# EAGLE design CPUBoard (EAGLE 6.1)
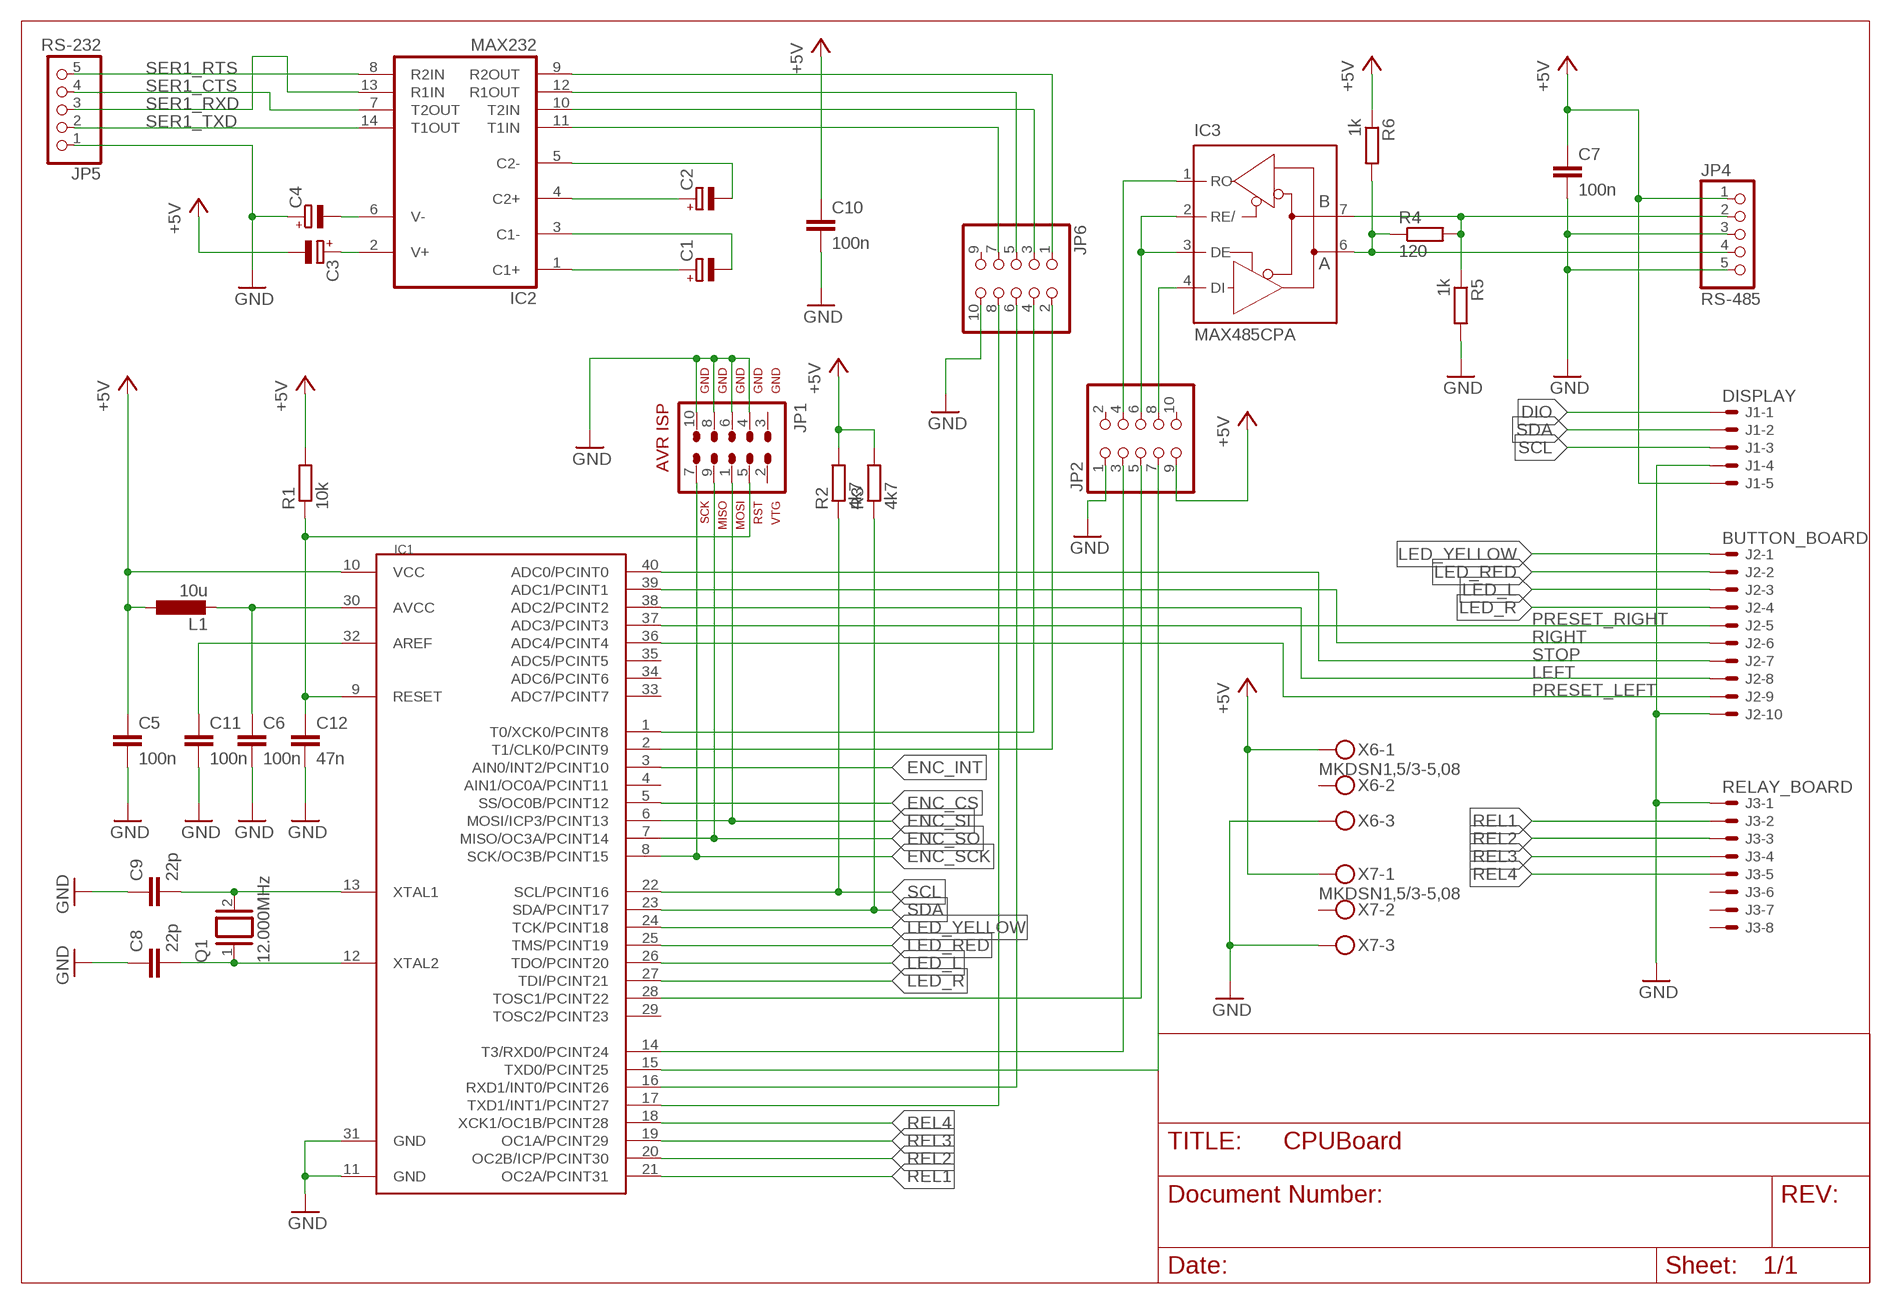
[diagram p0: schematic, sheet 1]

## Parts
C1  CPOL-EUE2,5-6E  [E2,5-6E]
C2  CPOL-EUE2,5-6E  [E2,5-6E]
C3  CPOL-EUE2,5-6E  [E2,5-6E]
C4  CPOL-EUE2,5-6E  [E2,5-6E]
C5  100n  C-EU025-025X050  [C025-025X050]
C6  100n  C-EU025-025X050  [C025-025X050]
C7  100n  C-EU025-025X050  [C025-025X050]
C8  22p  C-EU025-024X044  [C025-024X044]
C9  22p  C-EU025-024X044  [C025-024X044]
C10  100n  C-EU025-025X050  [C025-025X050]
C11  100n  C-EU025-025X050  [C025-025X050]
C12  47n  C-EU025-025X050  [C025-025X050]
IC1  MEGA1284P  [DIL40]
IC2  MAX232  [DIL16]
IC3  MAX485CPA  MAX481CPA  [DIL08]
J1  DISPLAY  22-27-2051-05  [6410-05]
J2  BUTTON_BOARD  22-27-2101-10  [6410-10]
J3  RELAY_BOARD  22-27-2081-08  [6410-08]
JP1  AVR-ISP-10  [AVR-ISP-10]
JP2  PINHD-2X5  [2X05]
JP4  RS-485  PINHD-1X5  [1X05]
JP5  RS-232  PINHD-1X5  [1X05]
JP6  PINHD-2X5  [2X05]
L1  10u  L-EU0207/10  [0207/10]
Q1  12.000MHz  XTAL/S  [QS]
R1  10k  R-EU_0207/10  [0207/10]
R2  4k7  R-EU_0207/10  [0207/10]
R3  4k7  R-EU_0207/10  [0207/10]
R4  120  R-EU_0207/10  [0207/10]
R5  1k  R-EU_0207/10  [0207/10]
R6  1k  R-EU_0207/10  [0207/10]
X6  MKDSN1,5/3-5,08  [MKDSN1,5/3-5,08]
X7  MKDSN1,5/3-5,08  [MKDSN1,5/3-5,08]

## Nets
+5V: C3.- C5.1 C7.1 C10.1 IC1.10(VCC) J1.5 JP2.9 JP4.1 L1.1 R1.2 R2.2 R3.2 R6.1 X6.1 X7.1
DIO: J1.1
ENC_CS: IC1.5(SS/OC0B/PCINT12)
ENC_INT: IC1.3(AIN0/INT2/PCINT10)
ENC_SCK: IC1.8(SCK/OC3B/PCINT15) JP1.7
ENC_SI: IC1.6(MOSI/ICP3/PCINT13) JP1.1
ENC_SO: IC1.7(MISO/OC3A/PCINT14) JP1.9
GND: C4.+ C5.2 C6.2 C7.2 C8.1 C9.1 C10.2 C11.2 C12.2 IC1.11(GND) IC1.31(GND) J1.4 J2.10 J3.1 JP1.4 JP1.6 JP1.8 JP1.10 JP2.1 JP4.3 JP4.5 JP5.1 JP6.10 R5.2 X6.3 X7.3
LED_L: IC1.26(TDO/PCINT20) J2.3
LED_R: IC1.27(TDI/PCINT21) J2.4
LED_RED: IC1.25(TMS/PCINT19) J2.2
LED_YELLOW: IC1.24(TCK/PCINT18) J2.1
LEFT: IC1.38(ADC2/PCINT2) J2.8
N$1: C9.2 IC1.13(XTAL1) Q1.2
N$2: C8.2 IC1.12(XTAL2) Q1.1
N$3: C12.1 IC1.9(RESET) JP1.5 R1.1
N$4: IC2.11(T1IN) JP6.7
N$5: C1.+ IC2.1(C1+)
N$6: C1.- IC2.3(C1-)
N$7: C2.+ IC2.4(C2+)
N$8: C2.- IC2.5(C2-)
N$9: C3.+ IC2.2(V+)
N$10: C4.- IC2.6(V-)
N$11: IC2.12(R1OUT) JP6.5
N$12: C6.1 IC1.30(AVCC) L1.2
N$13: IC1.14(T3/RXD0/PCINT24) JP2.3
N$14: IC1.15(TXD0/PCINT25) JP2.7
N$15: IC1.28(TOSC1/PCINT22) JP2.5
N$16: IC1.1(T0/XCK0/PCINT8) JP6.4
N$17: IC3.6(A) JP4.4 R4.1 R6.2
N$18: IC3.7(B) JP4.2 R4.2 R5.1
N$19: C11.1 IC1.32(AREF)
N$20: IC3.2(RE/) IC3.3(DE) JP2.6
N$21: IC3.4(DI) JP2.8
N$22: IC1.16(RXD1/INT0/PCINT26) JP6.6
N$23: IC3.1(RO) JP2.4
N$24: IC1.17(TXD1/INT1/PCINT27) JP6.8
N$25: IC1.2(T1/CLK0/PCINT9) JP6.2
N$28: IC2.9(R2OUT) JP6.1
N$29: IC2.10(T2IN) JP6.3
PRESET_LEFT: IC1.36(ADC4/PCINT4) J2.9
PRESET_RIGHT: IC1.37(ADC3/PCINT3) J2.5
REL1: IC1.21(OC2A/PCINT31) J3.2
REL2: IC1.20(OC2B/ICP/PCINT30) J3.3
REL3: IC1.19(OC1A/PCINT29) J3.4
REL4: IC1.18(XCK1/OC1B/PCINT28) J3.5
RIGHT: IC1.39(ADC1/PCINT1) J2.6
SCL: IC1.22(SCL/PCINT16) J1.3 R2.1
SDA: IC1.23(SDA/PCINT17) J1.2 R3.1
SER1_CTS: IC2.13(R1IN) JP5.3
SER1_RTS: IC2.8(R2IN) JP5.5
SER1_RXD: IC2.7(T2OUT) JP5.4
SER1_TXD: IC2.14(T1OUT) JP5.2
STOP: IC1.40(ADC0/PCINT0) J2.7
Unconnected: IC1.4(AIN1/OC0A/PCINT11) IC1.29(TOSC2/PCINT23) IC1.33(ADC7/PCINT7) IC1.34(ADC6/PCINT6) IC1.35(ADC5/PCINT5) J3.6 J3.7 J3.8 JP1.2 JP1.3 JP2.2 JP2.10 JP6.9 X6.2 X7.2

## Power pins joined to a net without a drawn wire
GND: IC2.15(GND) IC3.5(GND)
VCC: IC2.16(VCC) IC3.8(VCC)

## Library data of the parts
C1-C4 = rcl:CPOL-EU: POLARIZED CAPACITOR, European symbol
C5-C7 C10-C12 = rcl:C-EU: CAPACITOR, European symbol
C8 C9 = resistor:C-EU: CAPACITOR, European symbol
IC1 = 1284p:MEGA1284P: Atmel ATmega1284P 8-bit AVR Microcontroller
IC2 = maxim:MAX232: RS232 TRANSEIVER; MF: MAXIM; MPN: MAX232ACPE+; OC_FARNELL: 9723773; OC_NEWARK: 68K4544
IC3 = maxim:MAX481CPA: RS485 TRANSEIVER; MPN: MAX481CPA+; OC_FARNELL: unknown; OC_NEWARK: 99K3445
J1 = con-molex:22-?-05: CONNECTOR wire to board 2.54 mm (.1 inch) pitch header; OC_FARNELL: unknown; OC_NEWARK: unknown
J2 = con-molex:22-?-10: CONNECTOR wire to board 2.54 mm (.1 inch) pitch header; OC_FARNELL: unknown; OC_NEWARK: unknown
J3 = con-molex:22-?-08: CONNECTOR wire to board 2.54 mm (.1 inch) pitch header; OC_FARNELL: unknown; OC_NEWARK: unknown
JP1 = avr-4:AVR-ISP-10: AVR ISP-10 Serial Programming Header
JP2 JP6 = pinhead:PINHD-2X5: PIN HEADER
JP4 JP5 = pinhead:PINHD-1X5: PIN HEADER
L1 = rcl:L-EU: INDUCTOR, European symbol
Q1 = special:XTAL/S: CRYSTAL
R1-R6 = rcl:R-EU_: RESISTOR, European symbol
X6 X7 = con-phoenix-508:MKDSN1,5/3-5,08: MKDSN 1,5/ 3-5,08 Printklemme Nennstrom: 13,5 A Nennspannung: 250 V Rastermaß: 5,08 mm Polzahl: 3 Anschlussart: Schraubanschluss Montage: Löten Anschlussrichtung Leiter/Platine: 0 ° Artikelnummer: 1729131 Source: http://eshop.phoenixcontact.com .. 1729131.pdf; MPN: SMKDSN1,5/3-5,08; OC_FARNELL: 1792904; OC_NEWARK: 70R0299

## Board
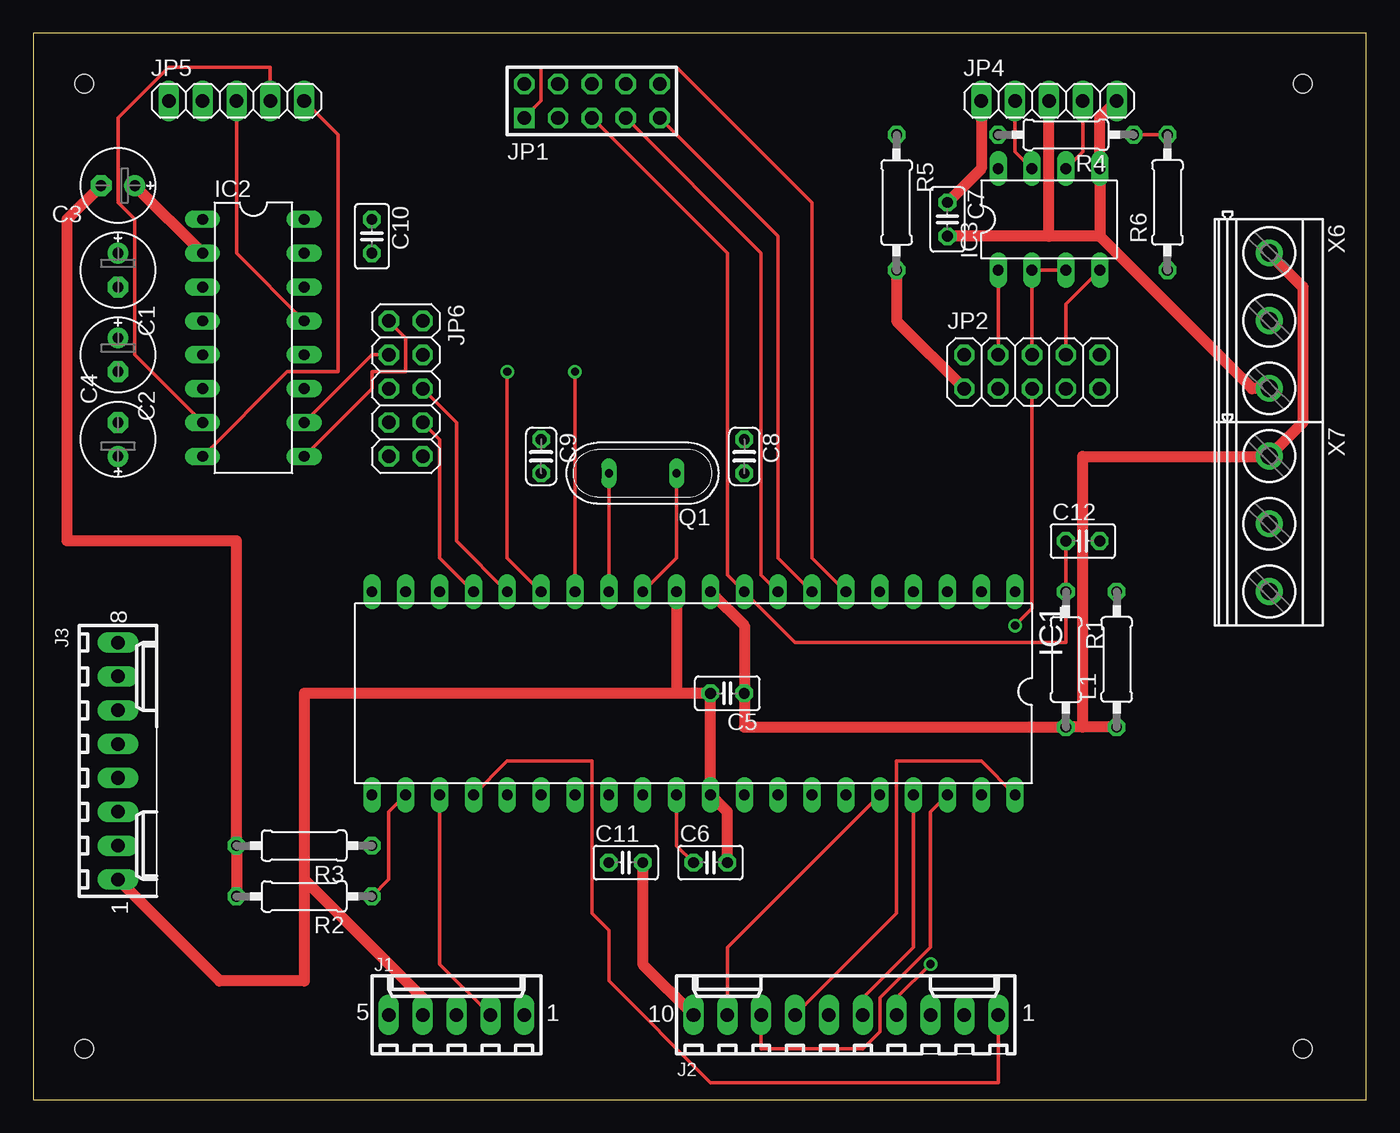
[diagram p1: board, top side]
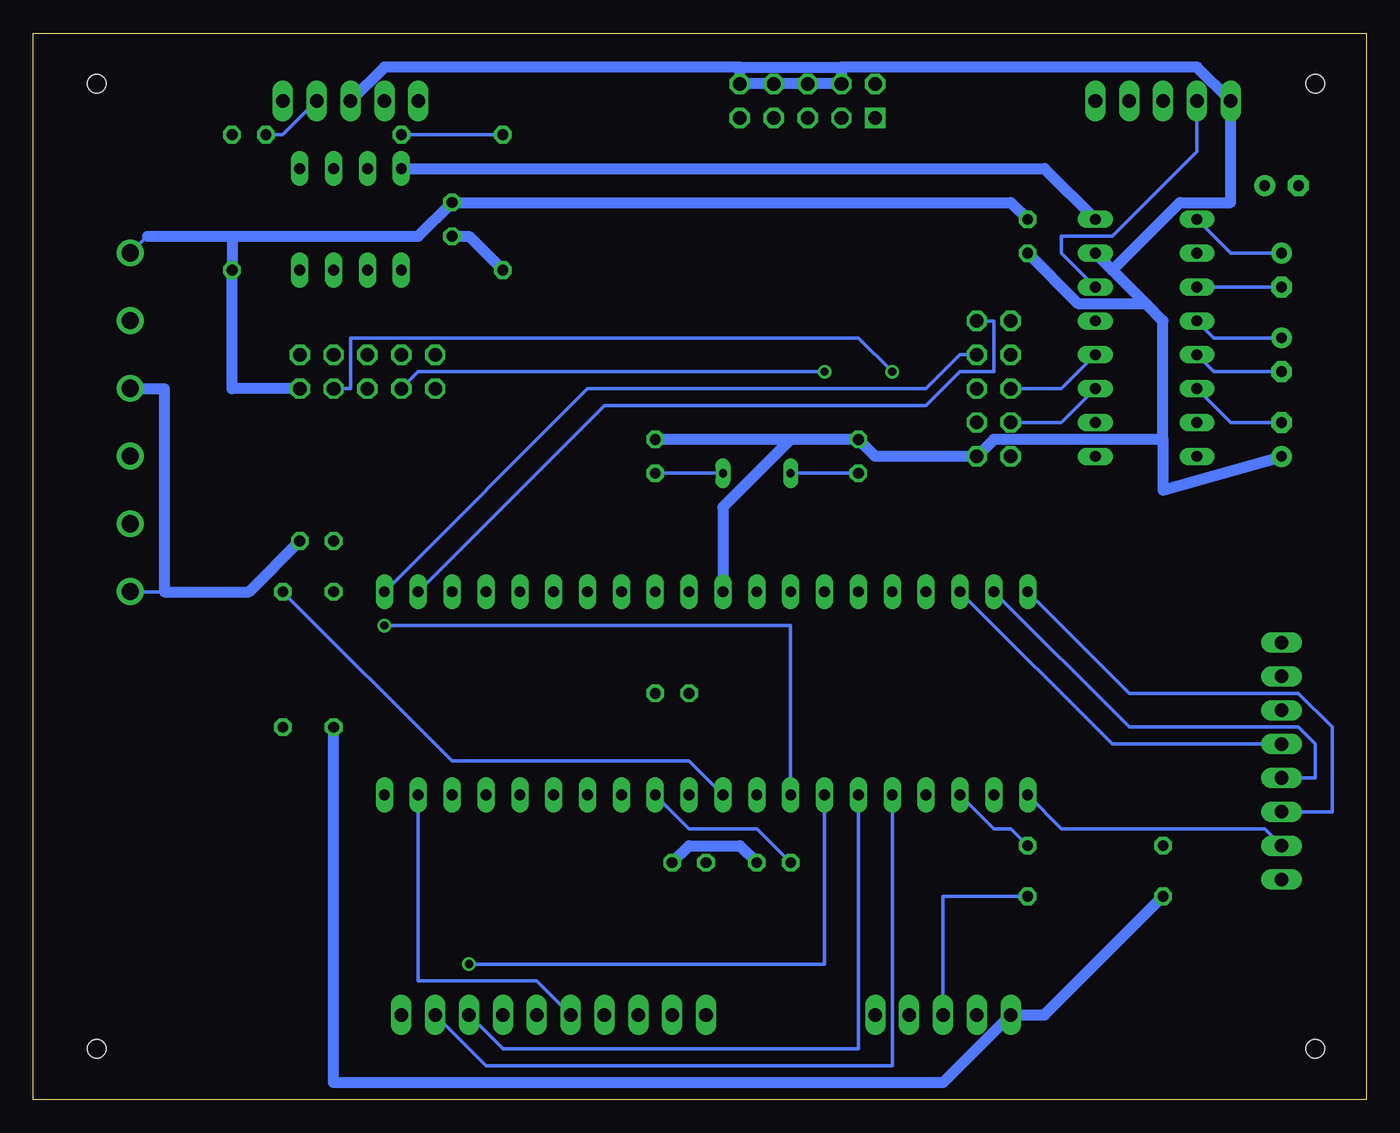
[diagram p2: board, bottom side, seen from below]

Size 100 x 80 mm. Coordinates in mm from the lower left corner, seen from the top.
Outline: 0,0 100,0 100,80 0,80 0,0
Copper layers (1*16): Top 0.035mm / dielectric 1.5mm / Bottom 0.035mm
Design rules: minimum track width 10mil, minimum drill 24mil, track to track 8mil, track to pad 8mil, pad to pad 8mil, via to via 8mil, smd to smd 8mil, copper to edge 40mil, drill to drill 8mil, minimum pad ring 10mil, minimum via ring 8mil, stop-mask expansion 4mil, vias tented up to drill 0mil, thermal gap 10mil
Holes 1.4 mm at 3.81,76.2 95.25,76.2 95.25,3.81 3.81,3.81

### Footprints (pad centres in the part's own frame; a part is rotated, then mirrored left to right if it is on the bottom)
E2,5-6E = drill 0.813 pad 1.575: + -1.27,0 | drill 0.813 pad 1.575 octagon: - 1.27,0
C025-025X050 = drill 0.813 octagon: 1 -1.27,0; 2 1.27,0
C025-024X044 = drill 0.813 octagon: 1 -1.27,0; 2 1.27,0
DIL40 = drill 0.813 long: 1 -24.13,-7.62; 2 -21.59,-7.62; 3 -19.05,-7.62; 4 -16.51,-7.62; 5 -13.97,-7.62; 6 -11.43,-7.62; 7 -8.89,-7.62; 8 -6.35,-7.62; 9 -3.81,-7.62; 10 -1.27,-7.62; 11 1.27,-7.62; 12 3.81,-7.62; 13 6.35,-7.62; 14 8.89,-7.62; 15 11.43,-7.62; 16 13.97,-7.62; 17 16.51,-7.62; 18 19.05,-7.62; 19 21.59,-7.62; 20 24.13,-7.62; 21 24.13,7.62; 22 21.59,7.62; 23 19.05,7.62; 24 16.51,7.62; 25 13.97,7.62; 26 11.43,7.62; 27 8.89,7.62; 28 6.35,7.62; 29 3.81,7.62; 30 1.27,7.62; 31 -1.27,7.62; 32 -3.81,7.62; 33 -6.35,7.62; 34 -8.89,7.62; 35 -11.43,7.62; 36 -13.97,7.62; 37 -16.51,7.62; 38 -19.05,7.62; 39 -21.59,7.62; 40 -24.13,7.62
DIL16 = drill 0.813 long: 1 -8.89,-3.81; 2 -6.35,-3.81; 3 -3.81,-3.81; 4 -1.27,-3.81; 5 1.27,-3.81; 6 3.81,-3.81; 7 6.35,-3.81; 8 8.89,-3.81; 9 8.89,3.81; 10 6.35,3.81; 11 3.81,3.81; 12 1.27,3.81; 13 -1.27,3.81; 14 -3.81,3.81; 15 -6.35,3.81; 16 -8.89,3.81
DIL08 = drill 0.813 long: 1 -3.81,-3.81; 2 -1.27,-3.81; 3 1.27,-3.81; 4 3.81,-3.81; 5 3.81,3.81; 6 1.27,3.81; 7 -1.27,3.81; 8 -3.81,3.81
6410-05 = drill 1.016 long: 1 5.08,0; 2 2.54,0; 3 0,0; 4 -2.54,0; 5 -5.08,0
6410-10 = drill 1.016 long: 1 11.43,0; 2 8.89,0; 3 6.35,0; 4 3.81,0; 5 1.27,0; 6 -1.27,0; 7 -3.81,0; 8 -6.35,0; 9 -8.89,0; 10 -11.43,0
6410-08 = drill 1.016 long: 1 8.89,0; 2 6.35,0; 3 3.81,0; 4 1.27,0; 5 -1.27,0; 6 -3.81,0; 7 -6.35,0; 8 -8.89,0
AVR-ISP-10 = drill 1.016 square: 1 -5.08,-1.27 | drill 1.016 octagon: 2 -5.08,1.27; 3 -2.54,-1.27; 4 -2.54,1.27; 5 0,-1.27; 6 0,1.27; 7 2.54,-1.27; 8 2.54,1.27; 9 5.08,-1.27; 10 5.08,1.27
2X05 = drill 1.016 octagon: 1 -5.08,-1.27; 2 -5.08,1.27; 3 -2.54,-1.27; 4 -2.54,1.27; 5 0,-1.27; 6 0,1.27; 7 2.54,-1.27; 8 2.54,1.27; 9 5.08,-1.27; 10 5.08,1.27
1X05 = drill 1.016 long: 1 -5.08,0; 2 -2.54,0; 3 0,0; 4 2.54,0; 5 5.08,0
0207/10 = drill 0.813 octagon: 1 -5.08,0; 2 5.08,0
QS = drill 0.61 long: 1 -2.54,0; 2 2.54,0
MKDSN1,5/3-5,08 = drill 1.3 pad 2: 1 -7.641,0.025; 2 -2.561,0.025; 3 2.519,0.025

### Placement (x,y rotation side)
C1  6.35,62.23 270 top
C2  6.35,55.88 270 top
C3  6.35,68.58 180 top
C4  6.35,49.53 90 top
C5  52.07,30.48 180 top
C6  50.8,17.78 0 top
C7  68.58,66.04 270 top
C8  53.34,48.26 270 top
C9  38.1,48.26 270 top
C10  25.4,64.77 270 top
C11  44.45,17.78 0 top
C12  78.74,41.91 0 top
IC1  49.53,30.48 180 top
IC2  16.51,57.15 270 top
IC3  76.2,66.04 0 top
J1  31.75,6.35 0 top
J2  60.96,6.35 0 top
J3  6.35,25.4 270 top
JP1  41.91,74.93 0 top
JP2  74.93,54.61 0 top
JP4  76.2,74.93 0 top
JP5  15.24,74.93 0 top
JP6  27.94,53.34 270 top
L1  81.28,33.02 90 top
Q1  45.72,46.99 180 top
R1  77.47,33.02 270 top
R2  20.32,15.24 180 top
R3  20.32,19.05 180 top
R4  77.47,72.39 180 top
R5  64.77,67.31 270 top
R6  85.09,67.31 90 top
X6  92.71,55.88 270 top
X7  92.71,40.64 270 top

### Tracks (layer width: path | path; a pad name or v marks a point on that pad's centre or on a via)
+5V
  Top 0.254: 92.71,63.5 X6.1 | 92.71,48.26 X7.1
  Top 0.813: C7.1 71.12,69.85 JP4.1 | 92.71,63.5 95.25,60.96 95.25,50.8 92.71,48.26 78.74,48.26 78.74,27.94 | L1.1 78.74,27.94 | 78.74,27.94 R1.2 53.34,27.94 C5.1 53.34,35.56 IC1.10 | R2.2 R3.2 15.24,41.91 2.54,41.91 2.54,66.04 C3.-
  Bottom 0.254: 91.44,64.77 92.71,63.5 X6.1
  Bottom 0.813: 91.44,64.77 85.09,64.77 | 85.09,64.77 71.12,64.77 C7.1 26.67,67.31 C10.1 | R2.2 24.13,6.35 J1.5 31.75,1.27 77.47,1.27 R1.2 | 85.09,64.77 R6.1 85.09,53.34 JP2.9
ENC_SCK
  Top 0.254: IC1.8 54.61,39.37 54.61,63.5 JP1.7
ENC_SI
  Top 0.254: IC1.6 58.42,40.64 58.42,67.31 48.26,77.47 38.1,77.47 38.1,74.93 JP1.1
ENC_SO
  Top 0.254: IC1.7 55.88,40.64 55.88,64.77 JP1.9
GND
  Top 0.254: 92.71,53.34 X6.3
  Top 0.813: 80.01,64.77 76.2,64.77 | 76.2,64.77 C7.2 | 80.01,64.77 IC3.5 80.01,73.66 JP4.5 | 76.2,64.77 JP4.3 | 80.01,64.77 91.44,53.34 92.71,53.34 | C6.2 52.07,21.59 IC1.31 C5.2 48.26,30.48 | J2.10 45.72,10.16 C11.2 | JP2.1 64.77,58.42 R5.2 | IC1.11 48.26,30.48 | 48.26,30.48 20.32,30.48 20.32,16.51 | 20.32,16.51 29.21,7.62 J1.4 | J3.1 13.97,8.89 20.32,8.89 20.32,16.51
  Bottom 0.254: 90.17,38.1 92.71,38.1 X7.3 | 92.71,53.34 X6.3
  Bottom 0.813: C11.2 46.99,19.05 50.8,19.05 C6.2 | 43.18,49.53 C9.1 36.83,48.26 JP6.10 27.94,49.53 15.24,49.53 | 43.18,49.53 C8.1 | 16.51,59.69 15.24,58.42 15.24,49.53 | 16.51,59.69 19.05,62.23 | 19.05,62.23 IC2.15 | 19.05,62.23 13.97,67.31 10.16,67.31 JP5.1 12.7,77.47 39.37,77.47 | JP4.3 73.66,77.47 46.99,77.47 | C12.2 83.82,38.1 90.17,38.1 90.17,53.34 92.71,53.34 | C10.2 21.59,59.69 16.51,59.69 | R5.2 67.31,64.77 C7.2 | C4.+ 15.24,45.72 15.24,49.53 | 46.99,77.47 JP1.10 JP1.8 JP1.6 JP1.4 39.37,77.47 | 46.99,77.47 39.37,77.47 | IC1.11 48.26,44.45 43.18,49.53
LED_L
  Bottom 0.254: J2.3 64.77,3.81 38.1,3.81 IC1.26
LED_R  (via drill 0.61)
  Top 0.254: v67.31,10.16 64.77,7.62 J2.4
  Bottom 0.254: IC1.27 40.64,10.16 v67.31,10.16
LED_RED
  Bottom 0.254: IC1.25 35.56,2.54 66.04,2.54 J2.2
LED_YELLOW
  Top 0.254: J2.1 72.39,1.27 50.8,1.27 43.18,8.89 43.18,12.7 41.91,13.97 41.91,25.4 35.56,25.4 IC1.24
LEFT
  Top 0.254: IC1.38 67.31,21.59 67.31,11.43 63.5,7.62 63.5,5.08 62.23,3.81 54.61,3.81 J2.8
N$1
  Top 0.254: Q1.2 IC1.13
  Bottom 0.254: C9.2 Q1.2
N$2
  Top 0.254: IC1.12 48.26,40.64 Q1.1
  Bottom 0.254: C8.2 Q1.1
N$3
  Top 0.254: C12.1 R1.1 77.47,34.29 57.15,34.29 IC1.9 52.07,39.37 52.07,63.5 JP1.5
N$4
  Bottom 0.254: IC2.11 22.86,50.8 JP6.7
N$5
  Bottom 0.254: IC2.1 10.16,63.5 C1.+
N$6
  Bottom 0.254: C1.- IC2.3
N$7
  Bottom 0.254: IC2.4 11.43,57.15 C2.+
N$8
  Bottom 0.254: IC2.5 11.43,54.61 C2.-
N$9
  Top 0.813: C3.+ IC2.2
N$10
  Bottom 0.254: IC2.6 10.16,50.8 C4.-
N$11
  Bottom 0.254: IC2.12 22.86,53.34 JP6.5
N$12
  Top 0.254: C6.1 48.26,19.05 IC1.30
  Bottom 0.254: L1.2 68.58,25.4 50.8,25.4 IC1.30
N$13  (via drill 0.61)
  Top 0.254: v40.64,54.61 IC1.14
  Bottom 0.254: v40.64,54.61 71.12,54.61 JP2.3
N$14  (via drill 0.61)
  Top 0.254: IC1.15 35.56,40.64 v35.56,54.61
  Bottom 0.254: v35.56,54.61 38.1,57.15 76.2,57.15 76.2,53.34 JP2.7
N$15  (via drill 0.61)
  Top 0.254: v73.66,35.56 74.93,36.83 JP2.5
  Bottom 0.254: v73.66,35.56 43.18,35.56 IC1.28
N$16
  Bottom 0.254: IC1.1 58.42,53.34 33.02,53.34 30.48,55.88 JP6.4
N$17
  Top 0.254: R6.2 R4.1 | IC3.6 78.74,71.12 JP4.4
  Bottom 0.254: R4.1 81.28,72.39 JP4.4
N$18
  Top 0.254: IC3.7 73.66,71.12 73.66,72.39 | JP4.2 73.66,72.39 | R4.2 73.66,72.39
  Bottom 0.254: R4.2 R5.1
N$19
  Bottom 0.254: C11.1 45.72,20.32 50.8,20.32 IC1.32
N$20
  Top 0.254: IC3.3 IC3.2 JP2.6
N$21
  Top 0.254: IC3.4 77.47,59.69 JP2.8
N$22
  Top 0.254: IC1.16 31.75,41.91 31.75,50.8 JP6.6
N$23
  Top 0.254: JP2.4 IC3.1
N$24
  Top 0.254: IC1.17 30.48,40.64 30.48,49.53 JP6.8
N$25
  Bottom 0.254: IC1.2 57.15,52.07 33.02,52.07 30.48,54.61 27.94,54.61 27.94,58.42 JP6.2
N$28
  Top 0.254: IC2.9 25.4,53.34 25.4,54.61 27.94,54.61 27.94,57.15 JP6.1
N$29
  Top 0.254: IC2.10 25.4,55.88 JP6.3
PRESET_LEFT
  Top 0.254: IC1.36 52.07,11.43 J2.9
PRESET_RIGHT
  Top 0.254: IC1.37 66.04,11.43 62.23,7.62 J2.5
REL1
  Bottom 0.254: IC1.21 22.86,20.32 7.62,20.32 J3.2
REL2
  Bottom 0.254: IC1.20 17.78,30.48 5.08,30.48 2.54,27.94 2.54,21.59 J3.3
REL3
  Bottom 0.254: IC1.19 17.78,27.94 5.08,27.94 3.81,26.67 3.81,24.13 J3.4
REL4
  Bottom 0.254: IC1.18 19.05,26.67 J3.5
RIGHT
  Bottom 0.254: IC1.39 71.12,8.89 62.23,8.89 J2.6
SCL
  Top 0.254: IC1.22 26.67,21.59 26.67,16.51 R2.1
  Bottom 0.254: J1.3 31.75,15.24 R2.1
SDA
  Top 0.254: J1.2 30.48,10.16 IC1.23
  Bottom 0.254: R3.1 26.67,20.32 27.94,20.32 IC1.23
SER1_CTS
  Top 0.254: IC2.13 15.24,63.5 JP5.3
SER1_RTS
  Top 0.254: IC2.8 19.05,54.61 22.86,54.61 22.86,72.39 JP5.5
SER1_RXD
  Top 0.254: IC2.7 7.62,55.88 7.62,66.04 6.35,67.31 6.35,73.66 10.16,77.47 17.78,77.47 JP5.4
SER1_TXD
  Bottom 0.254: IC2.14 22.86,63.5 22.86,64.77 19.05,64.77 12.7,71.12 JP5.2
STOP
  Top 0.254: IC1.40 71.12,25.4 64.77,25.4 64.77,13.97 J2.7
VCC
  Bottom 0.813: IC2.16 24.13,69.85 IC3.8